# EasyEDA Pro project ProPrj_OV_CLOCK_2026-03-21.epro

# Schematic Schematic1
Board Name: Board1; Create Date: 2025-12-01; Page Name: P1; Project Name: OV_CLOCK; Schematic Name: Schematic1; Update Date: 2025-12-12; Company: EasyEDA.com; Page Size: A4; Version: V1.0
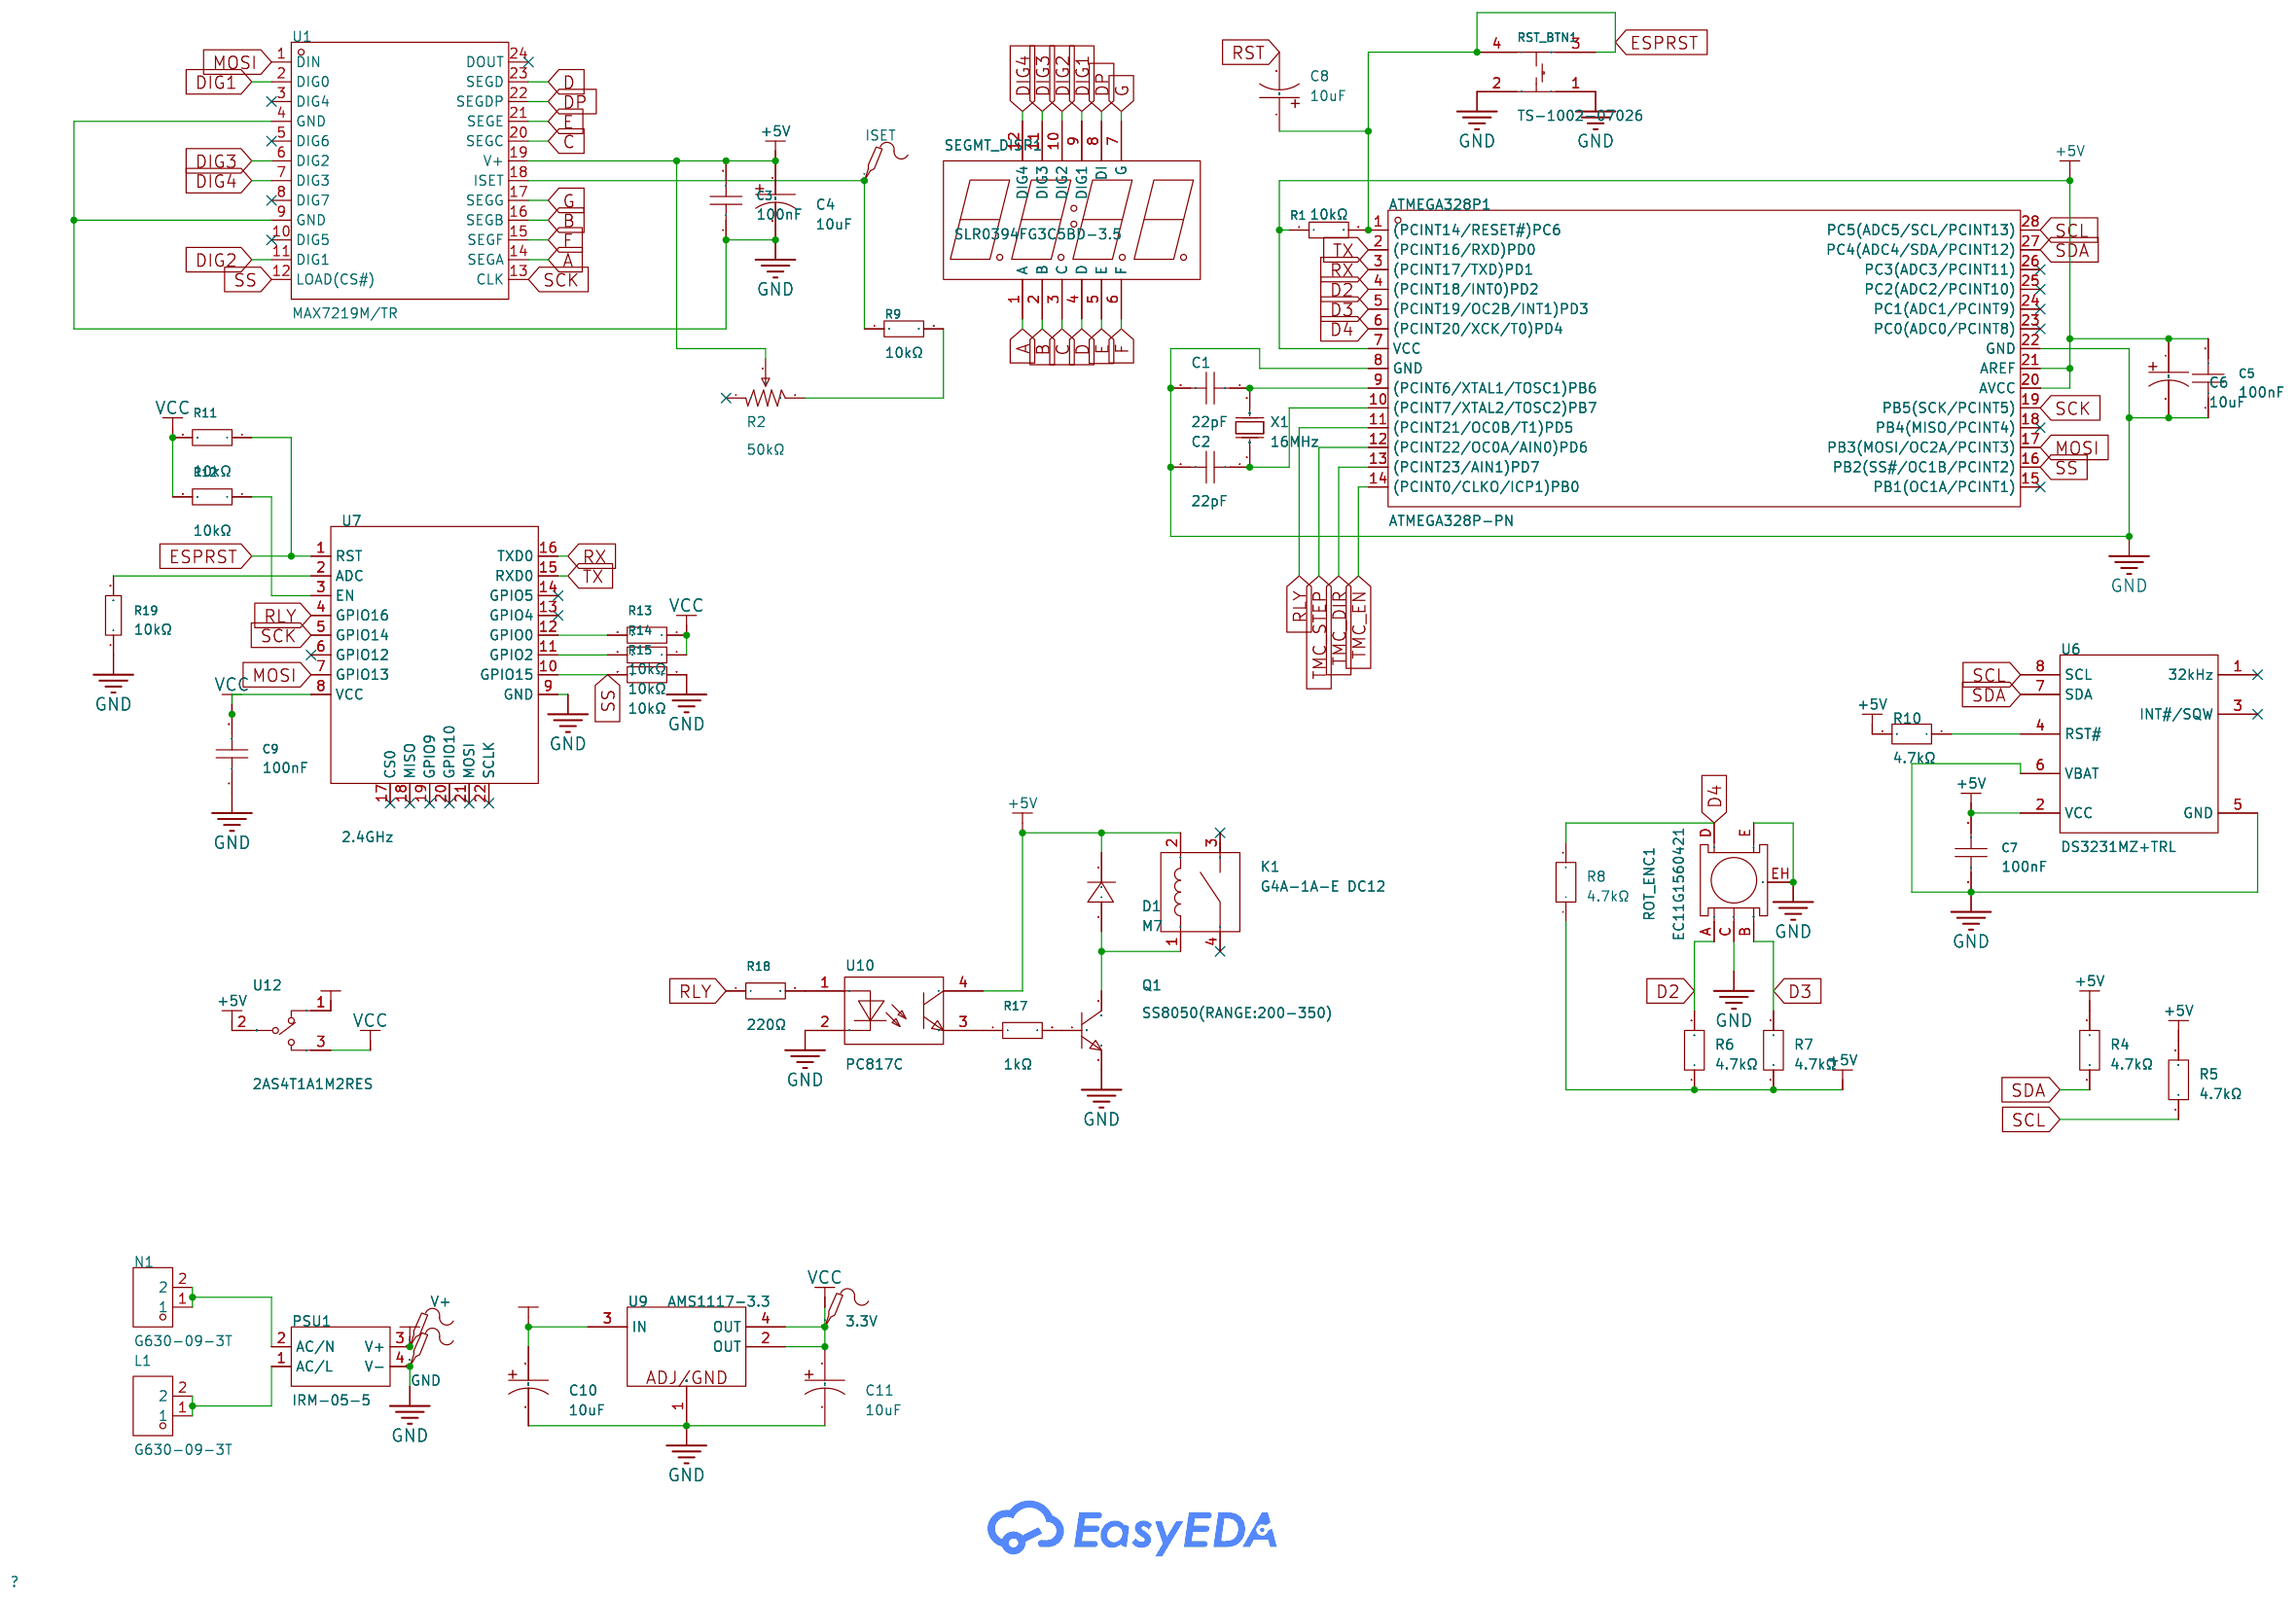
[diagram p0: schematic sheet]

## Parts
3.3V  -  [Test-Point-0.5mm]
ATMEGA328P1  ATMEGA328P-PN  [PDIP-28_L35.0-W7.3-P2.54-LS7.8-BL]
C1  22pF  [C0805]
C2  22pF  [C0805]
C3  100nF  [C0603]
C4  10uF  [CAP-TH_BD5.0-P2.00-D0.8-FD]
C5  100nF  [C0603]
C6  10uF  [CAP-TH_BD5.0-P2.00-D0.8-FD]
C7  100nF  [C0603]
C8  10uF  [CAP-TH_BD5.0-P2.00-D0.8-FD]
C9  100nF  [C0603]
C10  10uF  [CAP-TH_BD5.0-P2.00-D0.8-FD]
C11  10uF  [CAP-TH_BD5.0-P2.00-D0.8-FD]
D1  M7  [SMA_L4.3-W2.6-LS5.2-RD]
GND  -  [Test-Point-0.5mm]
ISET  -  [Test-Point-0.5mm]
K1  G4A-1A-E DC12  [RELAY-TH_G4A-1A-E]
L1  G630-09-3T  [CONN-TH_2P-L8.2-W0.8-P5.10]
N1  G630-09-3T  [CONN-TH_2P-L8.2-W0.8-P5.10]
PSU1  IRM-05-5  [PWRM-TH_IRM-05-5]
Q1  SS8050(RANGE:200-350)  [SOT-23-3_L2.9-W1.3-P1.90-LS2.4-BR]
R1  10kΩ  [R1206]
R2  50kΩ  [RES-ADJ-TH_3362P]
R4  4.7kΩ  [R1206]
R5  4.7kΩ  [R1206]
R6  4.7kΩ  [R1206]
R7  4.7kΩ  [R1206]
R8  4.7kΩ  [R1206]
R9  10kΩ  [R1206]
R10  4.7kΩ  [R1206]
R11  10kΩ  [R1206]
R12  10kΩ  [R1206]
R13  10kΩ  [R1206]
R14  10kΩ  [R1206]
R15  10kΩ  [R1206]
R17  1kΩ  [R1206]
R18  220Ω  [R1206]
R19  10kΩ  [R1206]
ROT_ENC1  EC11G1560421  [SW-TH_EC11G1560421]
RST_BTN1  TS-1002-07026  [SW-TH_4P-L6.0-W6.0-P4.50-LS6.5]
SEGMT_DISP1  SLR0394FG3C5BD-3.5  [LED-SEG-TH_SLR0394FG3C5BD-3.5]
U1  MAX7219M/TR  [SOP-24_L15.4-W7.5-P1.27-LS10.4-BL]
U6  DS3231MZ+TRL  [SOIC-8_L4.9-W3.9-P1.27-LS6.0-BL]
U7  2.4GHz  [WIFIM-SMD_ESP-12F-ESP8266MOD]
U9  AMS1117-3.3  [SOT-223-3_L6.4-W3.5-P2.30-LS7.0-BR]
U10  PC817C  [OPTO-SMD-4_L4.6-W6.5-P2.54-LS10.3-TL]
U12  2AS4T1A1M2RES  [SW-TH_3P-P2.54_2AS4T1A1M2RES]
V+  -  [Test-Point-0.5mm]
X1  16MHz  [HC-49S_L11.4-W4.8]

## Library data of the parts
3.3V GND ISET V+ = Test-Point: Test Point 测试点
ATMEGA328P1 = ATMEGA328P-PN: CPU Core:AVR CPU Maximum Speed:20MHz Program Storage Size:32KB Number of I/O:23 ADC (Bit):10bit Voltage - Supply:1.8V~5.5V Voltage - Supply:1.8V~5.5V Applications:-; LCSC Part Name: 基于AVR增强型RISC架构的低功耗CMOS 8位微控制器; Supplier Part: C1337455; Manufacturer: MICROCHIP(美国微芯); Supplier Footprint: PDIP-28; JLCPCB Part Class: Extended Part; Datasheet: https://atta.szlcsc.com/upload/public/pdf/source/20210601/C1337455_D238EEF2477FC71DEE6DB97D61B6D3AE.pdf; Supplier: LCSC; CPU Core: AVR; CPU Maximum Speed: 20MHz; Program Storage Size: 32KB; Number of I/O: 23; ADC (Bit): 10bit; Voltage - Supply: 1.8V~5.5V
C1 C2 = TCC0805COG220J500BT: Capacitance:22pF Tolerance:±5% Tolerance:±5% Voltage Rating:50V Temperature Coefficient:C0G; LCSC Part Name: 22pF ±5% 50V; Supplier Part: C376875; Manufacturer: CCTC(三环); Supplier Footprint: 0805; JLCPCB Part Class: Extended Part; Datasheet: https://item.szlcsc.com/datasheet/TCC0805COG220J500BT/349234.html; Supplier: LCSC; Tolerance: ±5%; Voltage Rating: 50V; Temperature Coefficient: C0G; Standardization Check: true
C3 C5 C7 C9 = CL10B104KB8NNNC: Capacitance:100nF Tolerance:±10% Tolerance:±10% Voltage Rating:50V Temperature Coefficient:X7R; LCSC Part Name: 100nF ±10% 50V; Supplier Part: C1591; Manufacturer: SAMSUNG(三星); Supplier Footprint: 0603; JLCPCB Part Class: Extended Part; Datasheet: https://item.szlcsc.com/datasheet/CL10B104KB8NNNC/1943.html; Supplier: LCSC; Tolerance: ±10%; Voltage Rating: 50V; Temperature Coefficient: X7R; Standardization Check: true
C4 C6 C8 C10 C11 = 50YXJ10M5X11: Capacitance:10uF Tolerance:±20% Tolerance:±20% Voltage Rating:50V Pin Spacing:2mm Diameter:5mm Height - Seated (Max):11mm Lifetime:5000hrs@105℃; LCSC Part Name: 10uF ±20% 50V; Supplier Part: C432355; Manufacturer: Rubycon(红宝石); Supplier Footprint: 插件,D5xL11mm; JLCPCB Part Class: Extended Part; Datasheet: https://item.szlcsc.com/datasheet/50YXJ10M5X11/429163.html; Supplier: LCSC; Tolerance: ±20%; Voltage Rating: 50V; Pin Spacing: 2mm; Diameter: 5mm; Height - Seated (Max): 11mm; Lifetime: 5000hrs@105℃; Standardization Check: true
D1 = M7_C95872: Diode Configuration:Independent Voltage - Forward(Vf@If):1.1V@1A Voltage - DC Reverse(Vr):1kV Current - Rectified:1A Reverse Leakage Current (Ir):5uA@1kV Non-Repetitive Peak Forward Surge Current:30A Operating Junction Temperature Range:-55℃~+150℃ Operati; LCSC Part Name: 1kV 1A; Supplier Part: C95872; Manufacturer: MDD(辰达半导体); Supplier Footprint: SMA(DO-214AC); JLCPCB Part Class: Basic Part; Datasheet: https://item.szlcsc.com/datasheet/M7/97076.html; Supplier: LCSC; Diode Configuration: Independent; Voltage - Forward(Vf@If): 1.1V@1A; Voltage - DC Reverse(Vr): 1kV; Current - Rectified: 1A; Reverse Leakage Current (Ir): 5uA@1kV; Non-Repetitive Peak Forward Surge Current: 30A; Operating Junction Temperature Range: -55℃~+150℃
K1 = G4A-1A-E DC12: Coil Voltage:12V Contact Form:1 Form A: 1A (SPST-NO) Number of Pins:- Contact Rating:- Switching Voltage(Max):250V@AC Contact Material:- Switching Current(Max):20A Coil Type:- Coil Resistance:- Contact Resistance:- Operate Time:20ms Release Time:10ms Oper; LCSC Part Name: 无锁存; Supplier Part: C1563460; Manufacturer: OMRON(欧姆龙); Supplier Footprint: 插件,15.7x30.1mm; JLCPCB Part Class: Extended Part; Datasheet: https://item.szlcsc.com/datasheet/G4A-1A-E%2520DC12/1654269.html; Supplier: LCSC; Coil Voltage: 12V; Contact Form: 1 Form A: 1A (SPST-NO); Switching Voltage(Max): 250V@AC; Switching Current(Max): 20A; Operate Time: 20ms; Release Time: 10ms; Operating Temperature: -20℃~+60℃
L1 N1 = G630-09-3T: LCSC Part Name: 6.3mmPCB焊接端子-插片; Supplier Part: C27636945; Manufacturer: SAMZO(三佐); Supplier Footprint: 插件; JLCPCB Part Class: Extended Part; Datasheet: https://item.szlcsc.com/datasheet/G630-09-3T/29374908.html; Supplier: LCSC; Standardization Check: true
PSU1 = IRM-05-5: LCSC Part Name: MW(明纬) 单输出封装型PCB安装型胶囊型绿色模块开关电源 AC-DC 5W IRM-05-5; Supplier Part: C48603696; Manufacturer: null; Supplier Footprint: DIP,45.7x25.4mm; JLCPCB Part Class: Extended Part; Datasheet: https://item.szlcsc.com/datasheet/IRM-05-5/50875454.html; Supplier: LCSC; Standardization Check: true
Q1 = SS8050(RANGE:200-350)_C2150: type:NPN Current - Collector(Ic):1.5A Collector - Emitter Voltage VCEO:25V Pd - Power Dissipation:300mW DC Current Gain:200@800mA,1V DC Current Gain:200@800mA,1V Transition frequency(fT):100MHz Current - Collector Cutoff:100nA Vce Saturation(VCE(sat)):500; LCSC Part Name: hfe=200~350 NPN 电流:1.5A 电压:25V; Supplier Part: C2150; Manufacturer: CJ(江苏长电/长晶); Supplier Footprint: SOT-23; JLCPCB Part Class: Basic Part; Datasheet: https://item.szlcsc.com/datasheet/SS8050(RANGE%253A200-350)/2507.html; Supplier: LCSC; type: NPN; Current - Collector(Ic): 1.5A; Collector - Emitter Voltage VCEO: 25V; Pd - Power Dissipation: 300mW; DC Current Gain: 200@800mA,1V; Transition frequency(fT): 100MHz; Current - Collector Cutoff: 100nA; Vce Saturation(VCE(sat)): 500mV@800mA,80mA; Operating Temperature: -55℃~+150℃; Emitter-Base Voltage(Vebo): 5V; Number: 1 NPN
R1 R9 R11-R15 R19 = 1206W4F1002T5E: Type:Thick Film Resistor Resistance:10kΩ Tolerance:±1% Tolerance:±1% Power(Watts):250mW Voltage-Supply(Max):200V Temperature Coefficient:±100ppm/℃ Temperature Coefficient:±100ppm/℃ Operating Temperature:-55℃~+155℃ Operating Temperature:-55℃~+155℃; LCSC Part Name: 10kΩ ±1% 250mW 厚膜电阻; Supplier Part: C17902; Manufacturer: UNI-ROYAL(厚声); Supplier Footprint: 1206; JLCPCB Part Class: Basic Part; Datasheet: https://item.szlcsc.com/datasheet/1206W4F1002T5E/18590.html; Supplier: LCSC; Type: Thick Film Resistor; Tolerance: ±1%; Power(Watts): 250mW; Voltage-Supply(Max): 200V; Temperature Coefficient: ±100ppm/℃; Operating Temperature: -55℃~+155℃; Standardization Check: true
R2 = 3362P-1-503_C48997904: Resistance:50kΩ Tolerance:±10% Tolerance:±10% Power(Watts):500mW Temperature Coefficient:±250ppm/℃ Temperature Coefficient:±250ppm/℃ Number of Turns:; LCSC Part Name: 3362P-1-503; Supplier Part: C48997904; Manufacturer: JIERR(捷而瑞); Manufacturer Part: 3362P-1-503; Supplier Footprint: 插件-3P,7x6.8mm; JLCPCB Part Class: Extended Part; Datasheet: https://item.szlcsc.com/datasheet/3362P-1-503/51342040.html; Supplier: LCSC; Tolerance: ±10%; Power(Watts): 500mW; Temperature Coefficient: ±250ppm/℃; Standardization Check: true
R4-R8 R10 = FRC1206J472 TS: Type:Thick Film Resistor Resistance:4.7kΩ Tolerance:±5% Tolerance:±5% Power(Watts):250mW Voltage-Supply(Max):200V Temperature Coefficient:±100ppm/℃ Temperature Coefficient:±100ppm/℃ Operating Temperature:-55℃~+155℃ Operating Temperature:-55℃~+155℃; LCSC Part Name: 4.7kΩ ±5% 250mW 厚膜电阻; Supplier Part: C2907499; Manufacturer: FOJAN(富捷); Supplier Footprint: 1206; JLCPCB Part Class: Extended Part; Supplier: LCSC; Type: Thick Film Resistor; Tolerance: ±5%; Power(Watts): 250mW; Voltage-Supply(Max): 200V; Temperature Coefficient: ±100ppm/℃; Operating Temperature: -55℃~+155℃; Standardization Check: true
R17 = 1206W4F1001T5E_C4410: Type:Thick Film Resistor Resistance:1kΩ Tolerance:±1% Tolerance:±1% Power(Watts):250mW Voltage-Supply(Max):200V Temperature Coefficient:±100ppm/℃ Temperature Coefficient:±100ppm/℃ Operating Temperature:-55℃~+155℃ Operating Temperature:-55℃~+155℃; LCSC Part Name: 1kΩ ±1% 250mW 厚膜电阻; Supplier Part: C4410; Manufacturer: UNI-ROYAL(厚声); Manufacturer Part: 1206W4F1001T5E; Supplier Footprint: 1206; JLCPCB Part Class: Basic Part; Datasheet: https://item.szlcsc.com/datasheet/1206W4F1001T5E/4817.html; Supplier: LCSC; Type: Thick Film Resistor; Tolerance: ±1%; Power(Watts): 250mW; Voltage-Supply(Max): 200V; Temperature Coefficient: ±100ppm/℃; Operating Temperature: -55℃~+155℃
R18 = 1206W4J0221T5E: Type:Thick Film Resistor Resistance:220Ω Tolerance:±5% Tolerance:±5% Power(Watts):250mW Voltage-Supply(Max):200V Temperature Coefficient:±100ppm/℃ Temperature Coefficient:±100ppm/℃ Operating Temperature:-55℃~+155℃ Operating Temperature:-55℃~+155℃; LCSC Part Name: 220Ω ±5% 250mW 厚膜电阻; Supplier Part: C25363; Manufacturer: UNI-ROYAL(厚声); Supplier Footprint: 1206; JLCPCB Part Class: Extended Part; Datasheet: https://item.szlcsc.com/datasheet/1206W4J0221T5E/26106.html; Supplier: LCSC; Type: Thick Film Resistor; Tolerance: ±5%; Power(Watts): 250mW; Voltage-Supply(Max): 200V; Temperature Coefficient: ±100ppm/℃; Operating Temperature: -55℃~+155℃
ROT_ENC1 = EC11G1560421: LCSC Part Name: 编码器; Supplier Part: C1322549; Manufacturer: ALPSALPINE(阿尔卑斯阿尔派); JLCPCB Part Class: Extended Part; Datasheet: https://atta.szlcsc.com/upload/public/pdf/source/20201225/C1322549_F56C5617DA14041F96F8C5F7E8032362.pdf; Supplier: LCSC; Standardization Check: true
RST_BTN1 = TS-1002-07026: Circuit:SPST Actuator Style:Round Button Mounting Type:Through Hole Length:6mm Width:6mm Switch Height:7mm Contact Current:50mA Voltage Rating:12V With Lamp:- Life:-; LCSC Part Name: 6*6*7mm 直插 轻触开关; Supplier Part: C455095; Manufacturer: XUNPU(讯普); Supplier Footprint: 插件,6x6mm; JLCPCB Part Class: Extended Part; Datasheet: https://item.szlcsc.com/datasheet/TS-1002-07026/457500.html; Supplier: LCSC; Circuit: SPST; Actuator Style: Round Button; Mounting Type: Through Hole; Length: 6mm; Width: 6mm; Switch Height: 7mm; Contact Current: 50mA; Voltage Rating: 12V; Standardization Check: true
SEGMT_DISP1 = SLR0394FG3C5BD-3.5: Number of Characters:4 Digit/Alpha Size(inch):0.39 Illumination Color:Green LED Polarity:Common Cathode; LCSC Part Name: 4位0.39英寸绿色数码管 共阴极; Supplier Part: C225905; Manufacturer: SUNLIGHT(光华); Supplier Footprint: 插件; JLCPCB Part Class: Extended Part; Datasheet: https://item.szlcsc.com/datasheet/SLR0394FG3C5BD-3.5/226155.html; Supplier: LCSC; Number of Characters: 4; Digit/Alpha Size(inch): 0.39; Illumination Color: Green; LED Polarity: Common Cathode; Standardization Check: true
U1 = MAX7219M/TR: Voltage - Supply:4V~5.5V Voltage - Supply:4V~5.5V; Supplier Part: C6705351; Manufacturer: HGSEMI(华冠); Supplier Footprint: SOP-24-300mil; JLCPCB Part Class: Extended Part; Datasheet: https://item.szlcsc.com/datasheet/MAX7219M%252FTR/7662094.html; Supplier: LCSC; Voltage - Supply: 4V~5.5V; Standardization Check: true
U6 = DS3231MZ+TRL: Interface:I2C Voltage - Supply:2.3V~5.5V Voltage - Supply:2.3V~5.5V Operating Temperature:-40℃~+85℃ Operating Temperature:-40℃~+85℃; LCSC Part Name: 高精度RTC集成MEMS谐振器; Supplier Part: C107410; Manufacturer: ADI(亚德诺)/MAXIM(美信); Supplier Footprint: SOIC-8; JLCPCB Part Class: Extended Part; Datasheet: https://item.szlcsc.com/datasheet/DS3231MZ%252BTRL/108629.html; Supplier: LCSC; Interface: I2C; Voltage - Supply: 2.3V~5.5V; Operating Temperature: -40℃~+85℃; Standardization Check: true
U7 = ESP-12F(ESP8266MOD): Core Processor:ESP8266 chip Wireless Standard:- Support Interface:GPIO；UART；I2C；PWM；SPI；ADC Frequency:2.4GHz Antenna Type:On-board PCB antenna Output Power:16dBm Output Power:16dBm Operating Voltage:3.3V Operating Voltage:3.3V Receive  Current:120mA Send; LCSC Part Name: 完整的802.11b/g/nWi-FiSoC模块 屏蔽罩上的丝印是：ESP8266MOD，ESP8266EX串口WIFI; Supplier Part: C82891; Manufacturer: Ai-Thinker(安信可); Supplier Footprint: SMD,16x24mm; JLCPCB Part Class: Extended Part; Datasheet: https://atta.szlcsc.com/upload/public/pdf/source/20210219/C82891_ABD84A460F4F056A2757267CCCA4B508.pdf; Supplier: LCSC; Core Processor: ESP8266 chip; Support Interface: GPIO；UART；I2C；PWM；SPI；ADC; Antenna Type: On-board PCB antenna; Output Power: 16dBm; Operating Voltage: 3.3V; Receive  Current: 120mA; Send  Current: 170mA; Sensitivity: -90dBm; Operating Temperature: -40℃~+85℃
U9 = AMS1117-3.3: Output Type:Fixed Voltage - Supply:15V Output Voltage:3.3V Output Voltage:3.3V Output Current:1A Power Supply Rejection Ratio (PSRR):- Voltage Dropout:1.3V@(1A) standby current:4mA Features:Over Current Protection；Over Temperature Protection Operating Tem; LCSC Part Name: 1A低压差线性稳压器; Supplier Part: C2992570; Manufacturer: 国芯佳品; Supplier Footprint: SOT-223-3; JLCPCB Part Class: Extended Part; Datasheet: https://item.szlcsc.com/datasheet/AMS1117-3.3/3457622.html; Supplier: LCSC; Output Type: Fixed; Voltage - Supply: 15V; Output Voltage: 3.3V; Output Current: 1A; Voltage Dropout: 1.3V@(1A); standby current: 4mA; Features: Over Current Protection；Over Temperature Protection; Operating Temperature: -40℃~+125℃@(Ta); Output Configuration: Positive; Number of Outputs: 1
U10 = PC817C_C3025164: Input type:DC Output Type:Phototransistor Voltage - Forward(Vf):1.2V Output Current:50mA Isolation Voltage(Vrms):5kV Reverse Voltage:6V Load Voltage:35V Number of Outputs:1 Vce Saturation(VCE(sat)):100mV@1mA,20mA Rise time:6us@2mA,100Ω Fall time:5us Opera; LCSC Part Name: C档 光电晶体管光电耦合器; Supplier Part: C3025164; Manufacturer: GOODWORK(固得沃克); Supplier Footprint: SMD-4P; JLCPCB Part Class: Extended Part; Datasheet: https://item.szlcsc.com/datasheet/PC817C/3553773.html; Supplier: LCSC; Input type: DC; Output Type: Phototransistor; Voltage - Forward(Vf): 1.2V; Output Current: 50mA; Isolation Voltage(Vrms): 5kV; Reverse Voltage: 6V; Load Voltage: 35V; Number of Outputs: 1; Vce Saturation(VCE(sat)): 100mV@1mA,20mA; Rise time: 6us@2mA,100Ω; Fall time: 5us; Operating Temperature: -55℃~+110℃; Current Transfer Ratio (CTR) Minimum: 200%; Current Transfer Ratio (CTR) Maximum/Saturation Value: 400%; Forward Current(If): 50mA
U12 = 2AS4T1A1M2RES: LCSC Part Name: 摇摆开关; Supplier Part: C20611706; Manufacturer: HOOYA(皓宇电子); Supplier Footprint: 插件,P=2.54mm; JLCPCB Part Class: Extended Part; Datasheet: https://item.szlcsc.com/datasheet/2AS4T1A1M2RES/21966553.html; Supplier: LCSC
X1 = X49SM16MSD2SC: Type:Crystal Oscillator Frequency:16MHz Normal temperature Frequency Tolerance:±20ppm Normal temperature Frequency Tolerance:±20ppm Load Capacitance:20pF Frequency Stability:±30ppm Frequency Stability:±30ppm Operating Temperature:-20℃~+70℃ Operating Tempe; LCSC Part Name: HC-49SMD 16MHZ 2P 49SMD 20PF ±20PPM -20~70℃（±30PPM）; Supplier Part: C12676; Manufacturer: YXC(扬兴晶振); Supplier Footprint: HC-49S-SMD; JLCPCB Part Class: Extended Part; Datasheet: https://item.szlcsc.com/datasheet/X49SM16MSD2SC/13312.html; Supplier: LCSC; Type: Crystal Oscillator; Normal temperature Frequency Tolerance: ±20ppm; Load Capacitance: 20pF; Frequency Stability: ±30ppm; Operating Temperature: -20℃~+70℃; Standardization Check: true

## Nets
+5V: ATMEGA328P1.7(VCC) ATMEGA328P1.20(AVCC) ATMEGA328P1.21(AREF) C3.2 C4.1 C5.2 C6.1 C7.2 D1.1(K) K1.2 R1.1 R2.2 R4.2 R5.2 R6.1 R7.1 R8.1 R10.2 U1.19(V+) U6.2(VCC) U10.4 U12.2(COM)
GND: ATMEGA328P1.8(GND) ATMEGA328P1.22(GND) C1.2 C2.2 C3.1 C4.2 C5.1 C6.2 C7.1 C9.1 C10.2 C11.2 GND.1 PSU1.4(V-) Q1.2(E) R15.1 R19.1 ROT_ENC1.C ROT_ENC1.E ROT_ENC1.EH RST_BTN1.1 RST_BTN1.2 U1.4(GND) U1.9(GND) U6.5(GND) U6.6(VBAT) U7.9(GND) U9.1(ADJ/GND) U10.2
VCC: 3.3V.1 C9.2 C11.1 R11.2 R12.2 R13.1 R14.1 U7.8(VCC) U9.2(OUT) U9.4(OUT) U12.3
A: SEGMT_DISP1.1(A) U1.14(SEGA)
B: SEGMT_DISP1.2(B) U1.16(SEGB)
C: SEGMT_DISP1.3(C) U1.20(SEGC)
D: SEGMT_DISP1.4(D) U1.23(SEGD)
D2: ATMEGA328P1.4((PCINT18/INT0)PD2) R6.2 ROT_ENC1.A
D3: ATMEGA328P1.5((PCINT19/OC2B/INT1)PD3) R7.2 ROT_ENC1.B
D4: ATMEGA328P1.6((PCINT20/XCK/T0)PD4) R8.2 ROT_ENC1.D
DIG1: SEGMT_DISP1.9(DIG1) U1.2(DIG0)
DIG2: SEGMT_DISP1.10(DIG2) U1.11(DIG1)
DIG3: SEGMT_DISP1.11(DIG3) U1.6(DIG2)
DIG4: SEGMT_DISP1.12(DIG4) U1.7(DIG3)
DP: SEGMT_DISP1.8(DI) U1.22(SEGDP)
E: SEGMT_DISP1.5(E) U1.21(SEGE)
ESPRST: ATMEGA328P1.1((PCINT14/RESET#)PC6) C8.1 R1.2 R11.1 RST_BTN1.3 RST_BTN1.4 U7.1(RST)
F: SEGMT_DISP1.6(F) U1.15(SEGF)
G: SEGMT_DISP1.7(G) U1.17(SEGG)
MOSI: ATMEGA328P1.17(PB3(MOSI/OC2A/PCINT3)) U1.1(DIN) U7.7(GPIO13)
RLY: ATMEGA328P1.11((PCINT21/OC0B/T1)PD5) R18.1 U7.4(GPIO16)
RST: C8.2
RX: ATMEGA328P1.3((PCINT17/TXD)PD1) U7.16(TXD0)
SCK: ATMEGA328P1.19(PB5(SCK/PCINT5)) U1.13(CLK) U7.5(GPIO14)
SCL: ATMEGA328P1.28(PC5(ADC5/SCL/PCINT13)) R5.1 U6.8(SCL)
SDA: ATMEGA328P1.27(PC4(ADC4/SDA/PCINT12)) R4.1 U6.7(SDA)
SS: ATMEGA328P1.16(PB2(SS#/OC1B/PCINT2)) R15.2 U1.12(LOAD(CS#)) U7.10(GPIO15)
TMC_DIR: ATMEGA328P1.13((PCINT23/AIN1)PD7)
TMC_EN: ATMEGA328P1.14((PCINT0/CLKO/ICP1)PB0)
TMC_STEP: ATMEGA328P1.12((PCINT22/OC0A/AIN0)PD6)
TX: ATMEGA328P1.2((PCINT16/RXD)PD0) U7.15(RXD0)
V+: C10.1 PSU1.3(V+) U9.3(IN) U12.1 V+.1
$1N1226: N1.1 N1.2 PSU1.2(AC/N)
$1N1246: L1.1 L1.2 PSU1.1(AC/L)
$1N1793: ATMEGA328P1.10((PCINT7/XTAL2/TOSC2)PB7) C2.1 X1.1(OSC1)
$1N1795: ATMEGA328P1.9((PCINT6/XTAL1/TOSC1)PB6) C1.1 X1.2(OSC2)
$1N2641: R2.3 R9.2
$1N2682: ISET.1 R9.1 U1.18(ISET)
$1N4114: R10.1 U6.4(RST#)
$1N6904: R12.1 U7.3(EN)
$1N7043: R13.2 U7.12(GPIO0)
$1N7121: R14.2 U7.11(GPIO2)
$1N8039: R18.2 U10.1
$1N8167: R17.1 U10.3
$1N8334: D1.2(A) K1.1 Q1.3(C)
$1N8435: Q1.1(B) R17.2
$1N8971: R19.2 U7.2(ADC)

Not connected (* = marked no-connect by the designer): ATMEGA328P1 15(PB1(OC1A/PCINT1))* 18(PB4(MISO/PCINT4))* 23(PC0(ADC0/PCINT8))* 24(PC1(ADC1/PCINT9))* 25(PC2(ADC2/PCINT10))* 26(PC3(ADC3/PCINT11))*; K1 3* 4*; R2 1*; U1 3(DIG4)* 5(DIG6)* 8(DIG7)* 10(DIG5)* 24(DOUT)*; U6 1(32kHz)* 3(INT#/SQW)*; U7 6(GPIO12)* 13(GPIO4)* 14(GPIO5)* 17(CS0)* 18(MISO)* 19(GPIO9)* 20(GPIO10)* 21(MOSI)* 22(SCLK)*

# Board PCB1
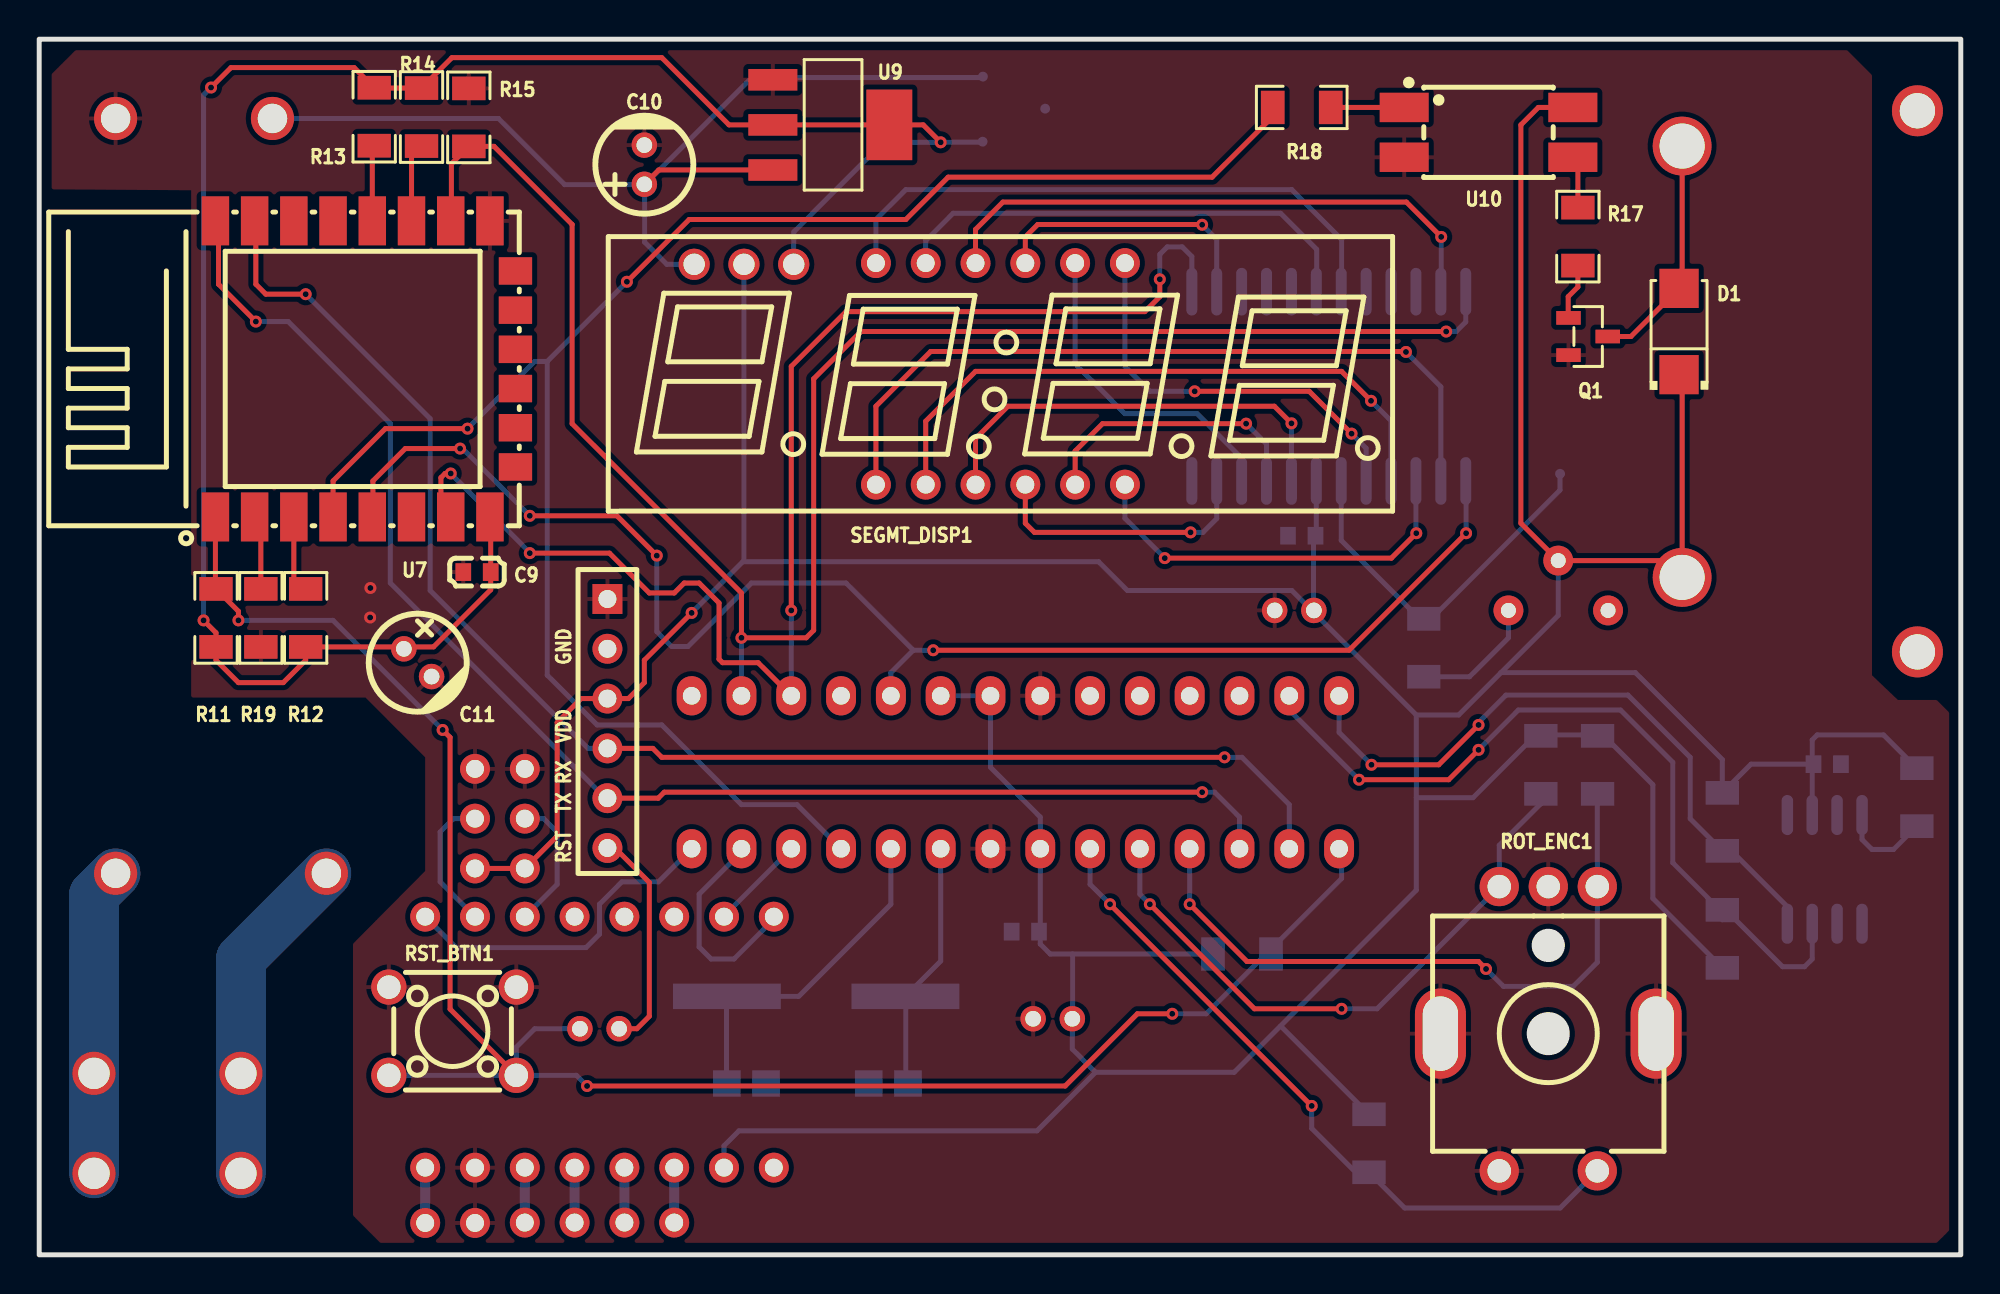
[diagram p1: board, top side]
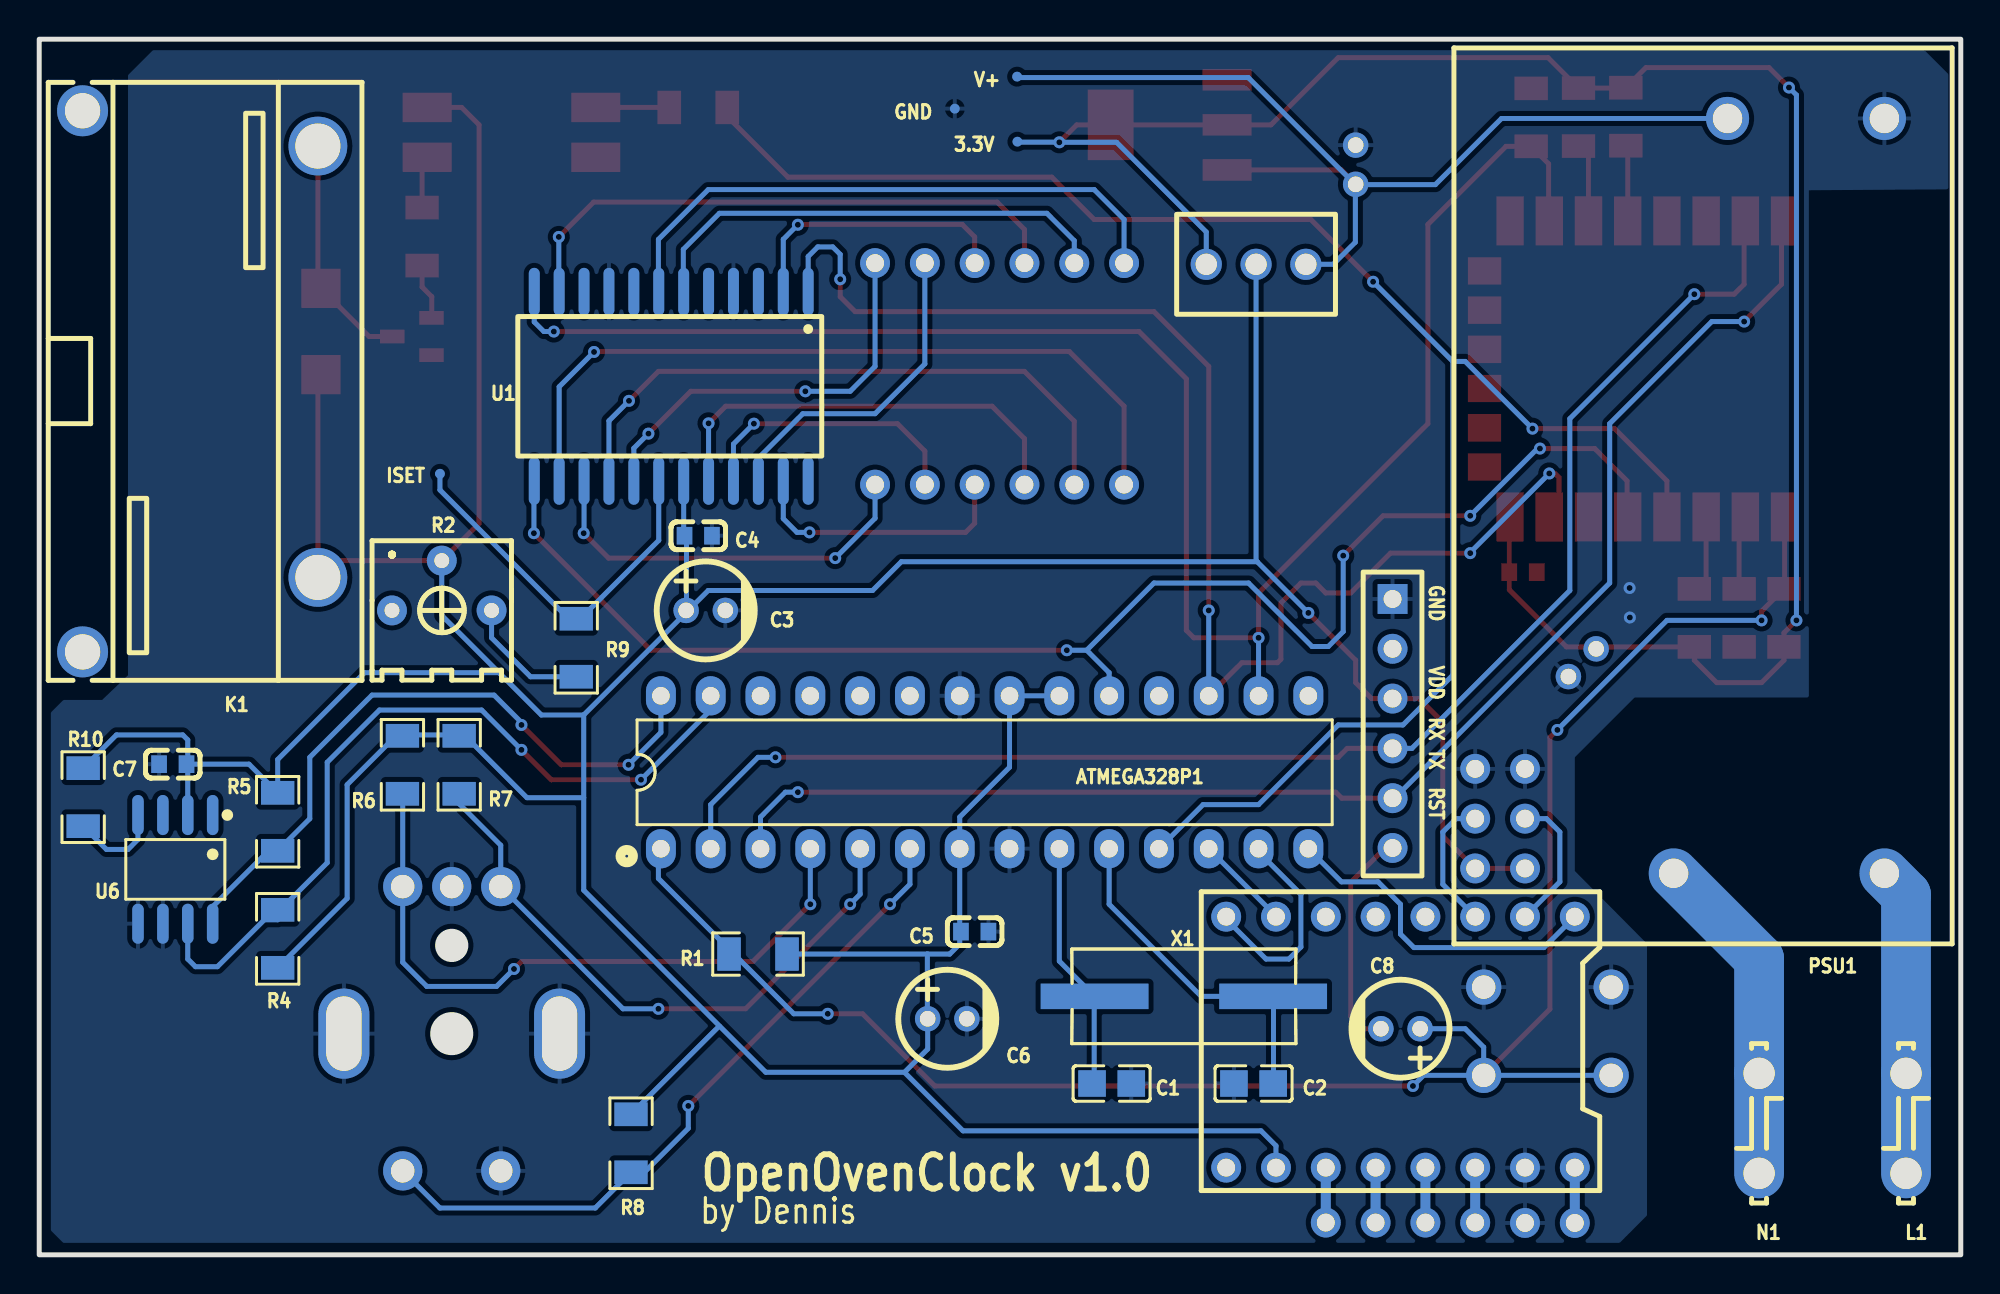
[diagram p2: board, bottom side, seen from below]

Outline 98 x 62 mm; copper layers: Top Layer, Bottom Layer. Coordinates in mm from the lower left corner of the outline.
Outline path: rectangle 0,62 98,0
Stack: Top Layer 0.035mm / Dielectric1 1.51mm FR4 er 4.5 / Bottom Layer 0.035mm

## Design rules (mm)
template: JLCPCB Capability(Two Layers Board)
spacing copperThickness1oz (default): track to track 0.102, other pairs 0.152 to 0.3
spacing copperThickness2oz: track to track 0.203, other pairs 0.152 to 0.3
track width copperThickness1oz (default): min 0.127, default 0.254, max 2.54
track width copperThickness2oz: min 0.203, default 0.254, max 2.54
differential pair differentialPair (default): width min 0.127, default 0.254, max 2.54; gap min 0.152, default 0.152
via viaSize (default): diameter min 0.5, default 0.61, max 10; hole min 0.3, default 0.305, max 6.3

## Placement (name value [footprint] x y rotation side)
3.3V  -  [Test-Point-0.5mm]  48.11 56.77 180 bottom
ATMEGA328P1  ATMEGA328P-PN  [PDIP-28_L35.0-W7.3-P2.54-LS7.8-BL]  49.78 24.61 180 bottom
C1  22pF  [C0805]  43.31 8.74 180 bottom
C2  22pF  [C0805]  36.07 8.74 0 bottom
C3  100nF  [C0603]  64.39 36.68 0 bottom
C4  10uF  [CAP-TH_BD5.0-P2.00-D0.8-FD]  64.01 32.87 180 bottom
C5  100nF  [C0603]  50.29 16.48 0 bottom
C6  10uF  [CAP-TH_BD5.0-P2.00-D0.8-FD]  51.69 12.04 180 bottom
C7  100nF  [C0603]  91.19 25.02 180 bottom
C8  10uF  [CAP-TH_BD5.0-P2.00-D0.8-FD]  28.57 11.53 0 bottom
C9  100nF  [C0603]  22.33 34.82 0 top
C10  10uF  [CAP-TH_BD5.0-P2.00-D0.8-FD]  30.86 55.6 90 top
C11  10uF  [CAP-TH_BD5.0-P2.00-D0.8-FD]  19.3 30.2 315 top
D1  M7  [SMA_L4.3-W2.6-LS5.2-RD]  83.63 47.09 90 top
GND  -  [Test-Point-0.5mm]  51.3 58.46 180 bottom
ISET  -  [Test-Point-0.5mm]  77.56 39.84 180 bottom
K1  G4A-1A-E DC12  [RELAY-TH_G4A-1A-E]  89.79 44.55 270 bottom
L1  G630-09-3T  [CONN-TH_2P-L8.2-W0.8-P5.10]  2.79 6.7 270 bottom
N1  G630-09-3T  [CONN-TH_2P-L8.2-W0.8-P5.10]  10.29 6.7 270 bottom
NOREF  -  [Pad_e3346]  22.22 1.62 90 top
NOREF#2  -  [Pad_e3147]  32.38 17.25 90 top
NOREF#3  -  [Pad_e3256]  24.77 1.64 90 top
NOREF#4  -  [Pad_e3553]  24.77 22.25 90 top
NOREF#5  -  [Pad_e3141]  22.22 17.25 90 top
NOREF#6  -  [Pad_e3140]  19.69 17.25 90 top
NOREF#7  -  [Pad_e992]  28.98 20.75 270 top
NOREF#8  -  [Pad_e3144]  27.31 17.25 90 top
NOREF#9  -  [Pad_e3151]  22.22 4.45 90 top
NOREF#10  -  [Pad_e3143]  24.77 17.25 90 top
NOREF#11  -  [Pad_e3150]  19.69 4.45 90 top
NOREF#12  -  [Pad_e3254]  29.84 1.64 90 top
NOREF#13  -  [Pad_e990]  28.98 33.45 270 top
NOREF#14  -  [Pad_e3154]  29.84 4.45 90 top
NOREF#15  -  [Pad_e3556]  22.22 24.79 90 top
NOREF#16  -  [Pad_e3153]  27.31 4.45 90 top
NOREF#17  -  [Pad_e3152]  24.77 4.45 90 top
NOREF#18  -  [Pad_e3155]  32.38 4.45 90 top
NOREF#19  -  [Pad_e3558]  22.22 19.71 90 top
NOREF#20  -  [Pad_e3557]  24.77 19.71 90 top
NOREF#21  -  [Pad_e3148]  34.93 17.25 90 top
NOREF#22  -  [Pad_e989]  28.98 25.83 270 top
NOREF#23  -  [Pad_e3345]  19.69 1.62 90 top
NOREF#24  -  [Pad_e3156]  34.93 4.45 90 top
NOREF#25  -  [Pad_e3253]  32.38 1.64 90 top
NOREF#26  -  [Pad_e3555]  24.77 24.79 90 top
NOREF#27  -  [Pad_e3157]  37.47 4.45 90 top
NOREF#28  -  [Pad_e1364]  28.98 30.91 270 top
NOREF#29  -  [Pad_e3149]  37.47 17.25 90 top
NOREF#30  -  [Pad_e3255]  27.31 1.64 90 top
NOREF#31  -  [Pad_e991]  28.98 28.37 270 top
NOREF#32  -  [Pad_e3554]  22.22 22.25 90 top
NOREF#33  -  [Pad_e987]  28.98 23.29 270 top
NOREF#34  -  [Pad_e3146]  29.84 17.25 90 top
PSU1  IRM-05-5  [PWRM-TH_IRM-05-5]  9.27 38.71 90 bottom
Q1  SS8050(RANGE:200-350)  [SOT-23-3_L2.9-W1.3-P1.90-LS2.4-BR]  78.99 46.84 180 top
R1  10kΩ  [R1206]  61.34 15.34 0 bottom
R2  50kΩ  [RES-ADJ-TH_3362P]  77.47 34.14 180 bottom
R4  4.7kΩ  [R1206]  85.84 16.12 270 bottom
R5  4.7kΩ  [R1206]  85.84 22.08 90 bottom
R6  4.7kΩ  [R1206]  79.48 24.99 270 bottom
R7  4.7kΩ  [R1206]  76.58 24.99 270 bottom
R8  4.7kΩ  [R1206]  67.82 5.69 270 bottom
R9  10kΩ  [R1206]  70.61 30.96 270 bottom
R10  4.7kΩ  [R1206]  95.76 23.34 90 bottom
R11  10kΩ  [R1206]  9.02 32.49 270 top
R12  10kΩ  [R1206]  13.59 32.49 270 top
R13  10kΩ  [R1206]  17.08 58.05 270 top
R14  10kΩ  [R1206]  19.5 58.03 270 top
R15  10kΩ  [R1206]  21.91 58.01 270 top
R17  1kΩ  [R1206]  78.47 51.93 270 top
R18  220Ω  [R1206]  64.39 58.52 0 top
R19  10kΩ  [R1206]  11.3 32.49 90 top
ROT_ENC1  EC11G1560421  [SW-TH_EC11G1560421]  76.96 11.53 180 top
RST_BTN1  TS-1002-07026  [SW-TH_4P-L6.0-W6.0-P4.50-LS6.5]  21.08 11.4 0 top
SEGMT_DISP1  SLR0394FG3C5BD-3.5  [LED-SEG-TH_SLR0394FG3C5BD-3.5]  49.02 44.93 0 top
U1  MAX7219M/TR  [SOP-24_L15.4-W7.5-P1.27-LS10.4-BL]  65.77 44.3 0 bottom
U6  DS3231MZ+TRL  [SOIC-8_L4.9-W3.9-P1.27-LS6.0-BL]  91.06 19.66 0 bottom
U7  2.4GHz  [WIFIM-SMD_ESP-12F-ESP8266MOD]  16.64 45.19 0 top
U9  AMS1117-3.3  [SOT-223-3_L6.4-W3.5-P2.30-LS7.0-BR]  40.39 57.63 180 top
U10  PC817C  [OPTO-SMD-4_L4.6-W6.5-P2.54-LS10.3-TL]  73.91 57.25 0 top
U12  2AS4T1A1M2RES  [SW-TH_3P-P2.54_2AS4T1A1M2RES]  35.94 50.52 270 bottom
V+  -  [Test-Point-0.5mm]  48.13 60.09 180 bottom
X1  16MHz  [HC-49S_L11.4-W4.8]  39.62 13.18 0 bottom

## Footprints (pads in the part's own frame, mm; a bottom-side part is the same pattern mirrored in y, then rotated)
C0603
  rect 0.8x0.9 smd: 1(-0.7,0) 2(0.7,0)
C0805
  rect 1.41x1.35 smd: 1(-1,0) 2(1,0)
CAP-TH_BD5.0-P2.00-D0.8-FD
  round 1.3 hole 0.8: 1(-1,0) 2(1,0)
CONN-TH_2P-L8.2-W0.8-P5.10
  round 2.2 hole 1.6: 1(-2.55,0) 2(2.55,0)
HC-49S_L11.4-W4.8
  rect 5.5x1.3 smd: 1(-4.553,0) 2(4.553,0)
LED-SEG-TH_SLR0394FG3C5BD-3.5
  round 1.524 hole 0.914: 1(-6.35,-5.65) 2(-3.81,-5.65) 3(-1.27,-5.65) 4(1.27,-5.65) 5(3.81,-5.65) 6(6.35,-5.65) 7(6.35,5.65) 8(3.81,5.65) 9(1.27,5.65) 10(-1.27,5.65) 11(-3.81,5.65) 12(-6.35,5.65)
OPTO-SMD-4_L4.6-W6.5-P2.54-LS10.3-TL
  rect 2.5x1.5 smd: 1(-4.3,1.27) 2(-4.3,-1.27) 3(4.3,-1.27) 4(4.3,1.27)
Pad_e987
  round 1.524 hole 0.914: 1(0,0)
Pad_e989
  round 1.524 hole 0.914: 1(0,0)
Pad_e990
  rect 1.524x1.524 hole 0.914: 1(0,0)
Pad_e991
  round 1.524 hole 0.914: 1(0,0)
Pad_e992
  round 1.524 hole 0.914: 1(0,0)
Pad_e1364
  round 1.524 hole 0.914: 1(0,0)
Pad_e3140
  round 1.524 hole 0.914: 1(0,0)
Pad_e3141
  round 1.524 hole 0.914: 2(0,0)
Pad_e3143
  round 1.524 hole 0.914: 3(0,0)
Pad_e3144
  round 1.524 hole 0.914: 4(0,0)
Pad_e3146
  round 1.524 hole 0.914: 5(0,0)
Pad_e3147
  round 1.524 hole 0.914: 6(0,0)
Pad_e3148
  round 1.524 hole 0.914: 7(0,0)
Pad_e3149
  round 1.524 hole 0.914: 8(0,0)
Pad_e3150
  round 1.524 hole 0.914: 9(0,0)
Pad_e3151
  round 1.524 hole 0.914: 10(0,0)
Pad_e3152
  round 1.524 hole 0.914: 11(0,0)
Pad_e3153
  round 1.524 hole 0.914: 12(0,0)
Pad_e3154
  round 1.524 hole 0.914: 13(0,0)
Pad_e3155
  round 1.524 hole 0.914: 14(0,0)
Pad_e3156
  round 1.524 hole 0.914: 15(0,0)
Pad_e3157
  round 1.524 hole 0.914: 16(0,0)
Pad_e3253
  round 1.524 hole 0.914: 14(0,0)
Pad_e3254
  round 1.524 hole 0.914: 13(0,0)
Pad_e3255
  round 1.524 hole 0.914: 12(0,0)
Pad_e3256
  round 1.524 hole 0.914: 11(0,0)
Pad_e3345
  round 1.524 hole 0.914: 9(0,0)
Pad_e3346
  round 1.524 hole 0.914: 10(0,0)
Pad_e3553
  round 1.524 hole 0.914: 2(0,0)
Pad_e3554
  round 1.524 hole 0.914: 1(0,0)
Pad_e3555
  round 1.524 hole 0.914: 2(0,0)
Pad_e3556
  round 1.524 hole 0.914: 1(0,0)
Pad_e3557
  round 1.524 hole 0.914: 2(0,0)
Pad_e3558
  round 1.524 hole 0.914: 1(0,0)
PDIP-28_L35.0-W7.3-P2.54-LS7.8-BL
  oval 1.524x2 hole 0.9: 1(-16.51,-3.9) 2(-13.97,-3.9) 3(-11.43,-3.9) 4(-8.89,-3.9) 5(-6.35,-3.9) 6(-3.81,-3.9) 7(-1.27,-3.9) 8(1.27,-3.9) 9(3.81,-3.9) 10(6.35,-3.9) 11(8.89,-3.9) 12(11.43,-3.9) 13(13.97,-3.9) 14(16.51,-3.9) 15(16.51,3.9) 16(13.97,3.9) 17(11.43,3.9) 18(8.89,3.9) 19(6.35,3.9) 20(3.81,3.9) 21(1.27,3.9) 22(-1.27,3.9) 23(-3.81,3.9) 24(-6.35,3.9) 25(-8.89,3.9) 26(-11.43,3.9) 27(-13.97,3.9) 28(-16.51,3.9)
PWRM-TH_IRM-05-5
  round 2.2 hole 1.5: 1(-19.25,-5.375) 2(-19.25,5.375) 3(19.25,2.625) 4(19.25,-5.375)
R1206
  rect 1.208x1.701 smd: 1(-1.479,0) 2(1.479,0)
RELAY-TH_G4A-1A-E
  round 3 hole 2.3: 1(-12,6) 2(10,6)
  round 2.6 hole 1.8: 3(13.8,-6) 4(-13.8,-6)
RES-ADJ-TH_3362P
  round 1.524 hole 0.762: 1(-2.54,-1.27) 2(0,1.27) 3(2.54,-1.27)
SMA_L4.3-W2.6-LS5.2-RD
  rect 2x2 smd: 1(-2.2,0) 2(2.2,0)
SOIC-8_L4.9-W3.9-P1.27-LS6.0-BL
  oval 0.588x2.045 smd: 1(-1.905,-2.772) 2(-0.635,-2.772) 3(0.635,-2.772) 4(1.905,-2.772) 5(1.905,2.772) 6(0.635,2.772) 7(-0.635,2.772) 8(-1.905,2.772)
SOP-24_L15.4-W7.5-P1.27-LS10.4-BL
  oval 0.56x2.432 smd: 1(-6.985,-4.826) 2(-5.715,-4.826) 3(-4.445,-4.826) 4(-3.175,-4.826) 5(-1.905,-4.826) 6(-0.635,-4.826) 7(0.635,-4.826) 8(1.905,-4.826) 9(3.175,-4.826) 10(4.445,-4.826) 11(5.715,-4.826) 12(6.985,-4.826) 13(6.985,4.826) 14(5.715,4.826) 15(4.445,4.826) 16(3.175,4.826) 17(1.905,4.826) 18(0.635,4.826) 19(-0.635,4.826) 20(-1.905,4.826) 21(-3.175,4.826) 22(-4.445,4.826) 23(-5.715,4.826) 24(-6.985,4.826)
SOT-23-3_L2.9-W1.3-P1.90-LS2.4-BR
  rect 1.25x0.7 smd: 1(1,-0.95) 2(1,0.95) 3(-1,0)
SOT-223-3_L6.4-W3.5-P2.30-LS7.0-BR
  rect 2.5x1.1 smd: 1(2.97,-2.3) 2(2.97,0) 3(2.97,2.3)
  rect 2.34x3.6 smd: 4(-2.97,0)
SW-TH_3P-P2.54_2AS4T1A1M2RES
  round 1.59 hole 1.09: 1(0,2.54) 2(0,0) 3(0,-2.54)
SW-TH_4P-L6.0-W6.0-P4.50-LS6.5
  round 1.8 hole 1.2: 1(-3.25,2.25) 2(3.25,2.25) 3(-3.25,-2.25) 4(3.25,-2.25)
SW-TH_EC11G1560421
  round 2 hole 1.2: A(-2.5,-7.25) B(2.5,-7.25) C(0,-7.25) D(-2.5,7.25) E(2.5,7.25)
  oval 2.6x4.6 hole 1.8x3.8: EH(-5.5,0.25) EH(5.5,0.25)
Test-Point-0.5mm
  round 0.5 smd: 1(0,0)
WIFIM-SMD_ESP-12F-ESP8266MOD
  rect 1.4x2.5 smd: 1(-7.651,-7.551) 2(-5.651,-7.551) 3(-3.651,-7.551) 4(-1.651,-7.551) 5(0.349,-7.551) 6(2.349,-7.551) 7(4.349,-7.551) 8(6.349,-7.551) 9(6.349,7.548) 10(4.349,7.55) 11(2.349,7.551) 12(0.349,7.551) 13(-1.651,7.55) 14(-3.651,7.551) 15(-5.651,7.551) 16(-7.651,7.551)
  rect 1.7x1.4 smd: 17(7.651,-5) 18(7.649,-3.002) 19(7.649,-1.004) 20(7.649,0.998) 21(7.649,2.997) 22(7.651,4.997)

## Nets
+5V: ATMEGA328P1.7 ATMEGA328P1.20 ATMEGA328P1.21 C3.2 C4.1 C5.2 C6.1 C7.2 D1.1 K1.2 NOREF#19.1 NOREF#20.2 NOREF#24.15 NOREF#31.1 R1.1 R2.2 R4.2 R5.2 R6.1 R7.1 R8.1 R10.2 U1.19 U6.2 U10.4 U12.2
GND: ATMEGA328P1.8 ATMEGA328P1.22 C1.2 C2.2 C3.1 C4.2 C5.1 C6.2 C7.1 C9.1 C10.2 C11.2 GND.1 NOREF.10 NOREF#9.10 NOREF#13.1 NOREF#15.1 NOREF#26.2 PSU1.4 Q1.2 R15.1 R19.1 ROT_ENC1.C ROT_ENC1.E ROT_ENC1.EH RST_BTN1.1 RST_BTN1.2 U1.4 U1.9 U6.5 U6.6 U7.9 U9.1 U10.2
VCC: 3.3V.1 C9.2 C11.1 R11.2 R12.2 R13.1 R14.1 U7.8 U9.2 U9.4 U12.3
A: SEGMT_DISP1.1 U1.14
B: SEGMT_DISP1.2 U1.16
C: SEGMT_DISP1.3 U1.20
D: SEGMT_DISP1.4 U1.23
D2: ATMEGA328P1.4 R6.2 ROT_ENC1.A
D3: ATMEGA328P1.5 R7.2 ROT_ENC1.B
D4: ATMEGA328P1.6 R8.2 ROT_ENC1.D
DIG1: SEGMT_DISP1.9 U1.2
DIG2: SEGMT_DISP1.10 U1.11
DIG3: SEGMT_DISP1.11 U1.6
DIG4: SEGMT_DISP1.12 U1.7
DP: SEGMT_DISP1.8 U1.22
E: SEGMT_DISP1.5 U1.21
ESPRST: ATMEGA328P1.1 C8.1 R1.2 R11.1 RST_BTN1.3 RST_BTN1.4 U7.1
F: SEGMT_DISP1.6 U1.15
G: SEGMT_DISP1.7 U1.17
MOSI: ATMEGA328P1.17 U1.1 U7.7
RLY: ATMEGA328P1.11 R18.1 U7.4
RST: C8.2 NOREF#7.1
RX: ATMEGA328P1.3 NOREF#33.1 U7.16
SCK: ATMEGA328P1.19 U1.13 U7.5
SCL: ATMEGA328P1.28 R5.1 U6.8
SDA: ATMEGA328P1.27 R4.1 U6.7
SS: ATMEGA328P1.16 R15.2 U1.12 U7.10
TMC_A1: NOREF#16.12 NOREF#30.12
TMC_A2: NOREF#3.11 NOREF#17.11
TMC_B1: NOREF#12.13 NOREF#14.13
TMC_B2: NOREF#18.14 NOREF#25.14
TMC_DIR: ATMEGA328P1.13 NOREF#29.8
TMC_EN: ATMEGA328P1.14 NOREF#6.1
TMC_GND: NOREF#27.16
TMC_MS1: NOREF#5.2 NOREF#32.1
TMC_MS2: NOREF#4.2 NOREF#10.3
TMC_RX: NOREF#34.5
TMC_SP: NOREF#8.4
TMC_STEP: ATMEGA328P1.12 NOREF#21.7
TMC_TX: NOREF#2.6
TMC_VM: NOREF#11.9 NOREF#23.9
TX: ATMEGA328P1.2 NOREF#22.1 U7.15
V+: C10.1 PSU1.3 U9.3 U12.1 V+.1
$1N1226: N1.1 N1.2 PSU1.2
$1N1246: L1.1 L1.2 PSU1.1
$1N1793: ATMEGA328P1.10 C2.1 X1.1
$1N1795: ATMEGA328P1.9 C1.1 X1.2
$1N2641: R2.3 R9.2
$1N2682: ISET.1 R9.1 U1.18
$1N4114: R10.1 U6.4
$1N6904: R12.1 U7.3
$1N7043: R13.2 U7.12
$1N7121: R14.2 U7.11
$1N8039: R18.2 U10.1
$1N8167: R17.1 U10.3
$1N8334: D1.2 K1.1 Q1.3
$1N8435: Q1.1 R17.2
$1N8971: R19.2 U7.2

Pads without a net: ATMEGA328P1 15 18 23 24 25 26; K1 3 4; NOREF#28 1; R2 1; U1 3 5 8 10 24; U6 1 3; U7 6 13 14 17 18 19 20 21 22

## Via types
v1: diameter 0.61, hole 0.305, Top Layer to Bottom Layer, 48 vias

## Routing (per net, layer and track width the routed paths; a pad name or vN(x,y) marks a point on that pad's centre or on a via; arc(x,y) is an arc through that point)
+5V: length 283.3
  Top Layer w0.254: v1(33.27,32.74) 30.86,30.33 30.86,29.18 30.05,28.37 NOREF#31.1 27.63,28.37 26.42,27.15 26.42,21.36 NOREF#20.2 NOREF#19.1 ; 83.63,44.89 83.79,44.74 K1.2 82.93,35.41 R2.2 75.56,37.31 75.56,57.63 76.45,58.52 U10.4
  Bottom Layer w0.254: 64.99,32.77 63.88,33.88 55.5,33.88 54.03,35.35 35.89,35.35 ; 64.99,32.77 64.99,36.58 65.13,36.72 U1.19 ; 64.99,32.77 70.23,27.53 ; R2.2 77.47,32.61 74.55,29.69 ; 35.89,35.35 35.94,35.41 U12.2 ; 35.89,35.35 v1(33.27,32.74) ; R10.2 94.06,26.52 90.68,26.52 90.42,26.26 90.42,25.09 C7.2 ; C7.2 87.3,25.02 R5.2 85.84,25.26 81.41,29.69 74.55,29.69 ; C7.2 90.42,24.96 U6.2 ; 53.87,9.31 50.89,6.32 35.69,6.32 34.93,5.56 NOREF#24.15 ; 53.87,9.31 52.69,10.49 C6.1 52.71,12.05 52.71,15.34 ; 53.87,9.31 60.94,9.31 70.23,18.6 70.23,23.31 ; 52.71,15.34 51.56,15.34 51.05,15.85 ATMEGA328P1.7 51.05,22.33 48.51,24.87 ATMEGA328P1.21 ATMEGA328P1.20 ; 52.71,15.34 R1.1 ; 70.23,23.31 70.23,27.53 ; 70.23,23.31 73.13,23.31 76.33,26.52 79.76,26.52 82.3,23.98 82.3,18.18 R4.2 ; 70.23,27.53 72.39,27.53 74.55,29.69 ; R8.1 63.32,11.67
GND:
  vias: v1(16.89,34.01) v1(16.88,32.5)
VCC: length 103.7
  Top Layer w0.254: v1(45.97,56.74) 45.09,57.63 U9.4 U9.2 35.18,57.63 31.75,61.06 21.05,61.06 R14.1 17.1,59.51 R13.1 16.06,60.55 9.78,60.55 v1(8.76,59.54) ; v1(8.38,32.36) 9.02,31.72 R11.2 9.02,30.33 10.16,29.18 12.45,29.18 13.59,30.33 R12.2 20.11,31.01 23.03,33.92 C9.2 23.03,37.59 U7.8
  Bottom Layer w0.254: U12.3 38.48,52.17 43.05,56.74 v1(45.97,56.74) 45.98,56.75 47.95,56.75 ; v1(8.38,32.36) 8.38,59.16 v1(8.76,59.54)
A: length 39.5
  Top Layer w0.254: SEGMT_DISP1.1 42.67,43.28 45.47,46.07 69.68,46.07 v1(69.71,46.05)
  Bottom Layer w0.254: v1(69.71,46.05) 71.48,44.27 U1.14
B: length 32.1
  Top Layer w0.254: SEGMT_DISP1.2 45.21,42.52 47.75,45.06 66.42,45.06 v1(67.92,43.56)
  Bottom Layer w0.254: U1.16 68.94,42.54 v1(67.92,43.56)
C: length 22.4
  Top Layer w0.254: v1(63.86,42.41) 62.99,43.28 49.4,43.28 47.75,41.63 SEGMT_DISP1.3
  Bottom Layer w0.254: U1.20 v1(63.86,42.41)
D: length 13.6
  Top Layer w0.254: SEGMT_DISP1.4 50.29,37.31 50.76,36.85 v1(58.72,36.85)
  Bottom Layer w0.254: 60.05,38.93 60.05,37.55 59.35,36.85 v1(58.72,36.85)
D2: length 34.5
  Top Layer w0.254: v1(73.79,14.58) 73.41,14.96 61.59,14.96 v1(58.67,17.88)
  Bottom Layer w0.254: v1(73.79,14.58) 74.68,13.69 78.23,13.69 79.46,14.92 79.46,23.5 R6.2 ; v1(58.67,17.88) ATMEGA328P1.4
D3: length 31.3
  Top Layer w0.254: v1(66.42,12.55) 61.98,12.55 v1(56.64,17.88)
  Bottom Layer w0.254: ATMEGA328P1.5 56.13,18.39 v1(56.64,17.88) ; v1(66.42,12.55) 68.23,12.55 74.46,18.78 74.46,20.89 76.58,23.01 R7.2
D4: length 36
  Top Layer w0.254: v1(64.9,7.59) 64.89,7.59 54.61,17.87 v1(54.61,17.88)
  Bottom Layer w0.254: ROT_ENC1.D 77.57,2.39 69.64,2.39 R8.2 67.14,4.21 64.9,6.45 v1(64.9,7.59) ; ATMEGA328P1.6 53.59,18.9 v1(54.61,17.88)
DIG1: length 14.3
  Top Layer w0.254: v1(59.31,52.54) 59.29,52.55 50.93,52.55 50.29,51.92 SEGMT_DISP1.9
  Bottom Layer w0.254: U1.2 60.05,51.79 v1(59.31,52.54)
DIG2: length 29.6
  Top Layer w0.254: v1(71.5,51.92) 69.72,53.69 49.15,53.69 47.75,52.3 SEGMT_DISP1.10
  Bottom Layer w0.254: U1.11 71.5,49.14 v1(71.5,51.92)
DIG3: length 24.6
  Bottom Layer w0.254: U1.6 65.15,49.14 65.15,51.28 63.31,53.12 46.61,53.12 45.21,51.72 SEGMT_DISP1.11
DIG4: length 30.3
  Bottom Layer w0.254: U1.7 66.42,49.14 66.42,51.79 63.88,54.33 44.2,54.33 42.67,52.81 SEGMT_DISP1.12
DP: length 16.8
  Bottom Layer w0.254: SEGMT_DISP1.8 52.83,45.44 55.37,42.9 59.06,42.9 61.32,40.63 U1.22
E: length 14.4
  Top Layer w0.254: SEGMT_DISP1.5 52.83,40.99 54.23,42.39 v1(61.55,42.39)
  Bottom Layer w0.254: U1.21 62.59,41.35 v1(61.55,42.39)
ESPRST: length 97.5
  Top Layer w0.254: U7.1 8.99,33.99 R11.1 10.16,32.82 v1(10.16,32.36) ; RST_BTN1.4 20.95,12.53 20.95,26.39 v1(20.57,26.77) ; v1(57.78,12.29) 56.01,12.29 52.32,8.61 v1(27.94,8.61)
  Bottom Layer w0.254: v1(20.57,26.77) 14.99,32.36 v1(10.16,32.36) ; RST_BTN1.4 27.4,9.15 v1(27.94,8.61) ; RST_BTN1.4 RST_BTN1.3 ; RST_BTN1.4 24.33,10.59 25.27,11.53 27.58,11.53 ; v1(57.78,12.29) 59.52,12.29 66.42,19.2 66.42,20.58 ATMEGA328P1.1
F: length 20.6
  Top Layer w0.254: v1(70.23,36.8) 68.96,35.53 v1(57.4,35.53)
  Bottom Layer w0.254: U1.15 70.21,36.82 v1(70.23,36.8) ; v1(57.4,35.53) 55.37,37.57 SEGMT_DISP1.6
G: length 21
  Top Layer w0.254: v1(66.93,41.88) 64.77,44.04 v1(58.93,44.04)
  Bottom Layer w0.254: U1.17 67.67,41.14 v1(66.93,41.88) ; v1(58.93,44.04) 56.64,44.04 55.37,45.31 SEGMT_DISP1.7
MOSI: length 70
  Top Layer w0.254: v1(20.99,39.85) 20.7,39.85 20.49,39.64 20.49,38.13 U7.7 ; v1(38.35,32.87) 38.35,45.31 41.15,48.11 56.39,48.11 57.15,48.87 v1(57.15,49.76) ; v1(25.02,35.79) 29.08,35.79 31.12,33.76 32.38,33.76 32.89,34.26 33.66,34.26 34.67,33.25 34.67,30.38 34.85,30.2 36.67,30.2 ATMEGA328P1.17
  Bottom Layer w0.254: v1(38.35,32.87) ATMEGA328P1.17 ; U1.1 58.78,50.92 58.29,51.41 57.53,51.41 57.15,51.03 v1(57.15,49.76) ; v1(20.99,39.85) 25.02,35.82 v1(25.02,35.79)
RLY: length 92.5
  Top Layer w0.254: U7.4 14.99,39.47 17.65,42.14 v1(21.84,42.14) ; 62.78,58.52 62.78,57.93 59.82,54.96 46.35,54.96 44.2,52.81 33.15,52.81 v1(29.97,49.63)
  Bottom Layer w0.254: ATMEGA328P1.11 38.65,22.96 35.81,22.96 31.75,27.02 28.45,27.02 25.91,29.56 25.91,45.57 ; v1(21.84,42.14) 25.27,45.57 25.91,45.57 ; 25.91,45.57 v1(29.97,49.63)
RST: length 11.5
  Top Layer w0.254: NOREF#7.1 29.36,20.75 31.12,18.99 31.12,12.17 30.48,11.53 C8.2
RX: length 73.6
  Top Layer w0.254: v1(11.05,47.6) 9.14,49.5 9.14,52.58 U7.16 ; v1(59.31,23.6) 31.88,23.6 31.57,23.29 NOREF#33.1
  Bottom Layer w0.254: ATMEGA328P1.3 61.21,22.33 59.94,23.6 v1(59.31,23.6) ; v1(11.05,47.6) 12.7,47.6 17.91,42.39 17.91,34.26 28.88,23.29 29.36,23.29
SCK: length 75.4
  Top Layer w0.254: v1(45.59,30.83) 66.8,30.83 v1(72.77,36.8) ; v1(21.46,41.12) 18.67,41.12 17.02,39.47 17.02,37.67 U7.5 ; v1(31.5,35.66) 29.46,37.69 v1(25.02,37.69)
  Bottom Layer w0.254: v1(72.77,36.8) 72.77,39.45 U1.13 ; 44.58,30.83 43.43,29.69 ATMEGA328P1.19 ; 44.58,30.83 41.15,34.26 36.32,34.26 33.08,31.02 32.26,31.02 31.5,31.79 v1(31.5,35.66) ; 44.58,30.83 v1(45.59,30.83) ; v1(21.46,41.12) 21.59,41.12 v1(25.02,37.69)
SCL: length 34.1
  Top Layer w0.254: v1(67.94,24.99) 71.37,24.99 v1(73.41,27.02)
  Bottom Layer w0.254: U6.8 89.15,17.75 86.3,20.61 R5.1 84.2,22.24 84.2,25.37 81.03,28.55 74.8,28.55 73.41,27.15 v1(73.41,27.02) ; v1(67.94,24.99) 66.29,26.64 ATMEGA328P1.28
SDA: length 41
  Top Layer w0.254: v1(67.31,24.23) 71.88,24.23 v1(73.41,25.75)
  Bottom Layer w0.254: v1(67.31,24.23) 63.75,27.79 ATMEGA328P1.27 ; U6.7 90.42,15.09 90.03,14.69 88.91,14.69 86.52,17.09 85.84,17.09 R4.1 85.71,17.59 83.31,19.99 83.31,25.12 80.65,27.79 75.44,27.79 v1(73.41,25.75)
SS: length 91.4
  Top Layer w0.254: v1(71.75,47.09) 41.91,47.09 39.5,44.68 39.5,31.85 39.12,31.47 v1(35.81,31.47) 35.81,33.76 27.18,42.39 27.18,52.55 23.19,56.54 R15.2 21.02,55.65 21.02,53.53 20.99,53.5 U7.10
  Bottom Layer w0.254: v1(35.81,31.47) ATMEGA328P1.16 ; v1(71.75,47.09) 72.26,47.09 72.75,47.58 U1.12
TMC_A1: length 2.8
  Bottom Layer w0.508: NOREF#16.12 NOREF#30.12
TMC_A2: length 2.8
  Bottom Layer w0.508: NOREF#17.11 NOREF#3.11
TMC_B1: length 2.8
  Bottom Layer w0.508: NOREF#14.13 NOREF#12.13
TMC_B2: length 2.8
  Bottom Layer w0.508: NOREF#18.14 NOREF#25.14
TMC_DIR: length 10.9
  Bottom Layer w0.254: NOREF#29.8 37.47,17.12 35.43,15.09 34.26,15.09 33.66,15.7 33.66,18.39 35.81,20.55 ATMEGA328P1.13
TMC_EN: length 17.2
  Bottom Layer w0.254: ATMEGA328P1.14 31.59,19.02 29.72,19.02 28.57,17.88 28.57,16.36 27.89,15.67 21.26,15.67 NOREF#6.1
TMC_MS1: length 7.1
  Bottom Layer w0.254: NOREF#5.2 20.45,19.02 20.45,21.56 21.13,22.25 NOREF#32.1
TMC_MS2: length 6.9
  Bottom Layer w0.254: NOREF#10.3 26.42,18.9 26.42,21.56 25.73,22.25 NOREF#4.2
TMC_STEP: length 4.9
  Bottom Layer w0.254: NOREF#21.7 34.93,17.28 ATMEGA328P1.12
TMC_VM: length 2.8
  Bottom Layer w0.508: NOREF#23.9 NOREF#11.9
TX: length 74.7
  Top Layer w0.254: U7.15 11.05,52.67 11.05,49.5 11.56,49 v1(13.59,49) ; NOREF#22.1 31.29,25.83 31.75,25.37 v1(60.45,25.37)
  Bottom Layer w0.254: ATMEGA328P1.2 63.75,22.96 61.34,25.37 v1(60.45,25.37) ; v1(13.59,49) 19.94,42.65 19.94,33.88 27.99,25.83 29.36,25.83
V+: length 52.7
  Top Layer w0.254: U9.3 31.59,55.33 C10.1
  Bottom Layer w0.254: U12.1 32,50.52 30.88,51.65 30.88,54.58 ; 48.13,60.04 36.34,60.04 30.88,54.58 ; 30.88,54.58 C10.1 ; 30.88,54.58 26.8,54.58 23.42,57.96 PSU1.3
$1N1226: length 17.1
  Bottom Layer w2.54: PSU1.2 10.29,15.1 N1.1 N1.2
$1N1246: length 15.8
  Bottom Layer w2.54: L1.2 L1.1 2.79,18.36 PSU1.1
$1N1793: length 17.7
  Bottom Layer w0.254: 34.81,8.74 35.05,8.97 35.05,13.16 X1.1 38.74,13.18 43.43,17.88 ATMEGA328P1.10
$1N1795: length 12.8
  Bottom Layer w0.254: ATMEGA328P1.9 45.97,14.98 X1.2 44.2,13.16 44.2,8.85 C1.1
$1N2641: length 6.5
  Bottom Layer w0.254: R2.3 74.93,31.47 72.94,29.48 R9.2
$1N2682: length 19.6
  Bottom Layer w0.254: 71.25,32.44 71.25,32.59 ; 71.25,32.59 71.25,32.69 77.56,39.01 77.56,39.71 77.69,39.84 ; 71.25,32.59 71.12,32.46 70.38,32.46 66.4,36.44 U1.18
$1N4114: length 4.7
  Bottom Layer w0.254: U6.4 92.96,21.18 93.47,20.67 94.57,20.67 R10.1
$1N6904: length 3.7
  Top Layer w0.254: 13.62,34 R12.1 ; U7.3 12.99,34
$1N7043: length 3.9
  Top Layer w0.254: R13.2 16.99,56.47 U7.12
$1N7121: length 4
  Top Layer w0.254: U7.11 18.99,53.12 18.99,53.12 18.99,56.04 19.5,56.55
$1N8039: length 3.9
  Top Layer w0.254: 65.74,58.52 U10.1
$1N8167: length 2.7
  Top Layer w0.254: R17.1 78.47,55.72 U10.3
$1N8334: length 12
  Top Layer w0.254: Q1.3 81.18,46.84 D1.2 83.79,49.45 K1.1
$1N8435: length 2.9
  Top Layer w0.254: R17.2 78.47,49.36 77.98,48.87 77.98,47.8 Q1.1
$1N8971: length 3.8
  Top Layer w0.254: R19.2 11.3,37.32 U7.2

## Copper pours and planes (outline as drawn; the poured copper is in the pictures)
GND on Top Layer: 97.41,1.24 97.41,27.66 96.77,28.3 94.79,28.3 93.47,29.56 93.47,60.17 92.2,61.44 1.85,61.44 0.64,60.22 0.64,54.34 7.75,54.3 7.75,28.42 16.64,28.42 19.69,25.37 19.69,19.57 16,15.87 16,7.26 16,7.26 16,2 17.4,0.61 96.77,0.61
GND on Bottom Layer: 97.41,1.24 97.41,27.66 96.77,28.3 94.79,28.3 93.47,29.56 93.47,60.17 92.2,61.44 1.85,61.44 0.64,60.22 0.64,54.34 7.75,54.3 7.75,28.42 16.64,28.42 19.69,25.37 19.69,19.57 16,15.87 16,7.26 16,7.26 16,2 17.4,0.61 96.77,0.61

## Text on the board
Bottom Silkscreen Layer: GND     VDD  RX TX  RST | by Dennis | OpenOvenClock v1.0
Top Silkscreen Layer: RST  TX RX  VDD     GND
